# EAGLE schematic 5V buckboost (EAGLE 8.6.3)
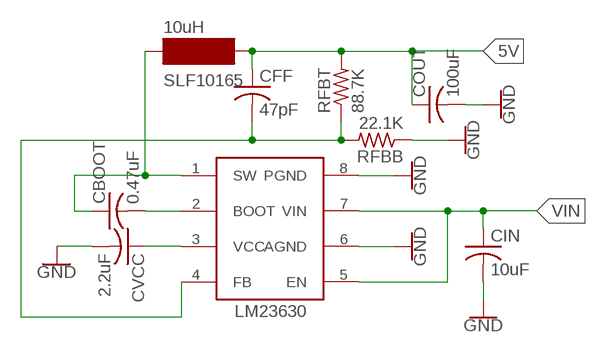
[diagram p0: schematic, sheet 1]

## Parts
CBOOT  0.47uF  C-USC1206  [C1206]
CFF  47pF  C-USC1206  [C1206]
CIN  10uF  C-USC1206  [C1206]
COUT  100uF  C-USC1206  [C1206]
CVCC  2.2uF  C-USC1206  [C1206]
RFBB  22.1K  R-US_M1206  [M1206]
RFBT  88.7K  R-US_M1206  [M1206]
SLF10165  10uH  SLF10165  [10.1*10.1]
U$1  LM23630  [SOIC127P602X168-8N]

## Nets
5V: CFF.1 COUT.1 RFBT.2 SLF10165.P$2
GND: CIN.2 COUT.2 CVCC.2 RFBB.1 U$1.6(AGND) U$1.8(PGND)
N$1: CBOOT.2 U$1.2(BOOT)
N$2: CBOOT.1 SLF10165.P$1 U$1.1(SW)
N$3: CVCC.1 U$1.3(VCC)
N$5: CFF.2 RFBB.2 RFBT.1 U$1.4(FB)
VIN: CIN.1 U$1.5(EN) U$1.7(VIN)

## Notes on the sheet
- LM23630

## Library data of the parts
CBOOT CFF CIN COUT CVCC = resistor:C-US: CAPACITOR, American symbol
RFBB RFBT = resistor:R-US_: RESISTOR, American symbol
SLF10165 = Inductors:SLF10165
U$1 = SOIC127P602X168-8N:LM23630: LM23630 5V 3A